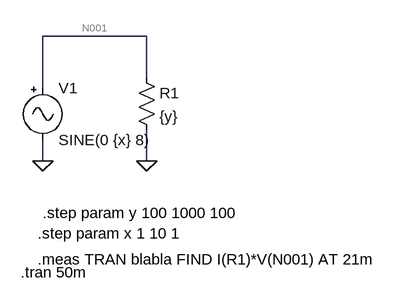
[diagram p0: schematic Draft1.asc]
Draft1.asc, the LTspice schematic file:
Version 4
SHEET 1 880 680
WIRE 176 80 16 80
WIRE 176 144 176 80
WIRE 16 160 16 80
WIRE 16 272 16 240
WIRE 176 272 176 224
FLAG 16 272 0
FLAG 176 272 0
SYMBOL Misc\\signal 16 144 R0
WINDOW 123 0 0 Left 0
WINDOW 39 0 0 Left 0
SYMATTR InstName V1
SYMATTR Value SINE(0 {x} 8)
SYMBOL res 160 128 R0
SYMATTR InstName R1
SYMATTR Value {y}
TEXT 8 384 Left 2 !.step param x 1 10 1
TEXT 8 424 Left 2 !.meas TRAN blabla FIND I(R1)*V(N001) AT 21m
TEXT -18 444 Left 2 !.tran 50m
TEXT 16 352 Left 2 !.step param y 100 1000 100

The netlist it stands for:
* Draft1.asc
V1 N001 0 SINE(0 {x} 8)
R1 N001 0 {y}
.step param x 1 10 1
.meas TRAN blabla FIND I(R1)*V(N001) AT 21m
.tran 50m
.step param y 100 1000 100
.backanno
.end